# EAGLE design M784new (EAGLE 6.6.0)
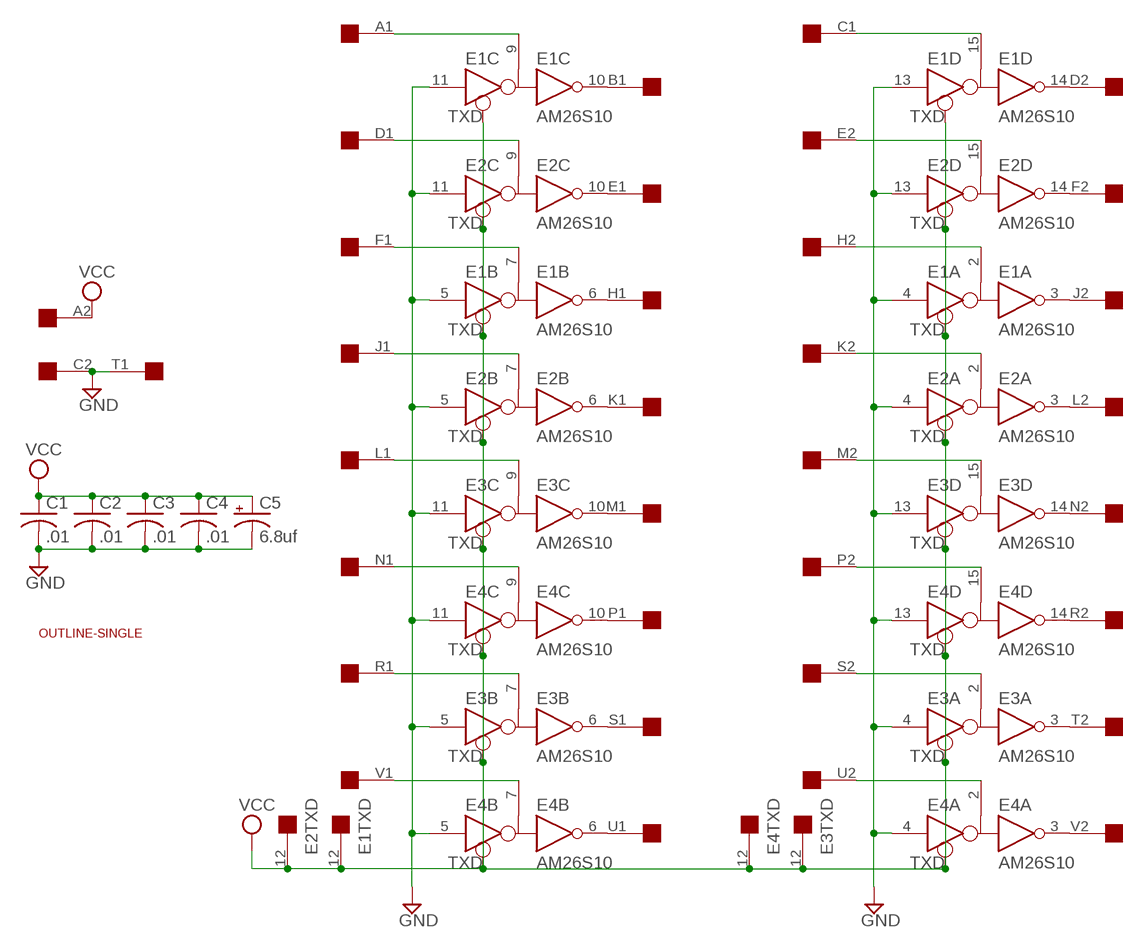
[diagram p0: schematic, sheet 1]

## Parts
C1  .01  C-US050-025X075  [C050-025X075]
C2  .01  C-US050-025X075  [C050-025X075]
C3  .01  C-US050-025X075  [C050-025X075]
C4  .01  C-US050-025X075  [C050-025X075]
C5  6.8uf  CPOL-USE15-5AXIAL  [E15-5]
E1  AM26S10  [DIL16]
E2  AM26S10  [DIL16]
E3  AM26S10  [DIL16]
E4  AM26S10  [DIL16]
U$1  SINGLE  [EDGE-CON2]
U$2  OUTLINE-SINGLE  [SINGLE]

## Nets
GND: C1.2 C2.2 C3.2 C4.2 C5.- E1.4(A:D) E1.5(B:D) E1.11(C:D) E1.13(D:D) E2.4(A:D) E2.5(B:D) E2.11(C:D) E2.13(D:D) E3.4(A:D) E3.5(B:D) E3.11(C:D) E3.13(D:D) E4.4(A:D) E4.5(B:D) E4.11(C:D) E4.13(D:D) U$1.C2 U$1.T1
N$1: E3.10(C:R) U$1.M1
N$2: E3.9(C:B) U$1.L1
N$3: E2.15(D:B) U$1.E2
N$4: E1.14(D:R) U$1.D2
N$5: E4.9(C:B) U$1.N1
N$6: E1.10(C:R) U$1.B1
N$7: E2.2(A:B) U$1.K2
N$8: E2.10(C:R) U$1.E1
N$9: E2.7(B:B) U$1.J1
N$10: E4.10(C:R) U$1.P1
N$11: E1.6(B:R) U$1.H1
N$12: E4.7(B:B) U$1.V1
N$13: E3.6(B:R) U$1.S1
N$14: E2.14(D:R) U$1.F2
N$15: E3.7(B:B) U$1.R1
N$16: E4.6(B:R) U$1.U1
N$17: E1.15(D:B) U$1.C1
N$18: E1.3(A:R) U$1.J2
N$19: E2.3(A:R) U$1.L2
N$20: E1.2(A:B) U$1.H2
N$21: E3.14(D:R) U$1.N2
N$22: E4.14(D:R) U$1.R2
N$23: E3.3(A:R) U$1.T2
N$24: E4.3(A:R) U$1.V2
N$25: E2.6(B:R) U$1.K1
N$26: E3.15(D:B) U$1.M2
N$27: E4.15(D:B) U$1.P2
N$28: E1.7(B:B) U$1.F1
N$29: E3.2(A:B) U$1.S2
N$30: E2.9(C:B) U$1.D1
N$31: E4.2(A:B) U$1.U2
N$32: E1.9(C:B) U$1.A1
VCC: C1.1 C2.1 C3.1 C4.1 C5.+ E1.12(TXD:TXD) E2.12(TXD:TXD) E3.12(TXD:TXD) E4.12(TXD:TXD) U$1.A2
Unconnected: U$1.B2

## Power pins joined to a net without a drawn wire
GND: E1.1(GND:GND) E1.8(PWR:GND) E2.1(GND:GND) E2.8(PWR:GND) E3.1(GND:GND) E3.8(PWR:GND) E4.1(GND:GND) E4.8(PWR:GND)
VCC: E1.16(PWR:VCC) E2.16(PWR:VCC) E3.16(PWR:VCC) E4.16(PWR:VCC)

## Library data of the parts
C1-C4 = rcl:C-US: CAPACITOR, American symbol
C5 = rcl:CPOL-US: POLARIZED CAPACITOR, American symbol
E1-E4 = dec-con:AM26S10: Bus Transceiver
U$1 = dec-con:SINGLE: Single-Height DEC board
U$2 = dec-con:OUTLINE-*: Board outlines for DEC boards.

## Board
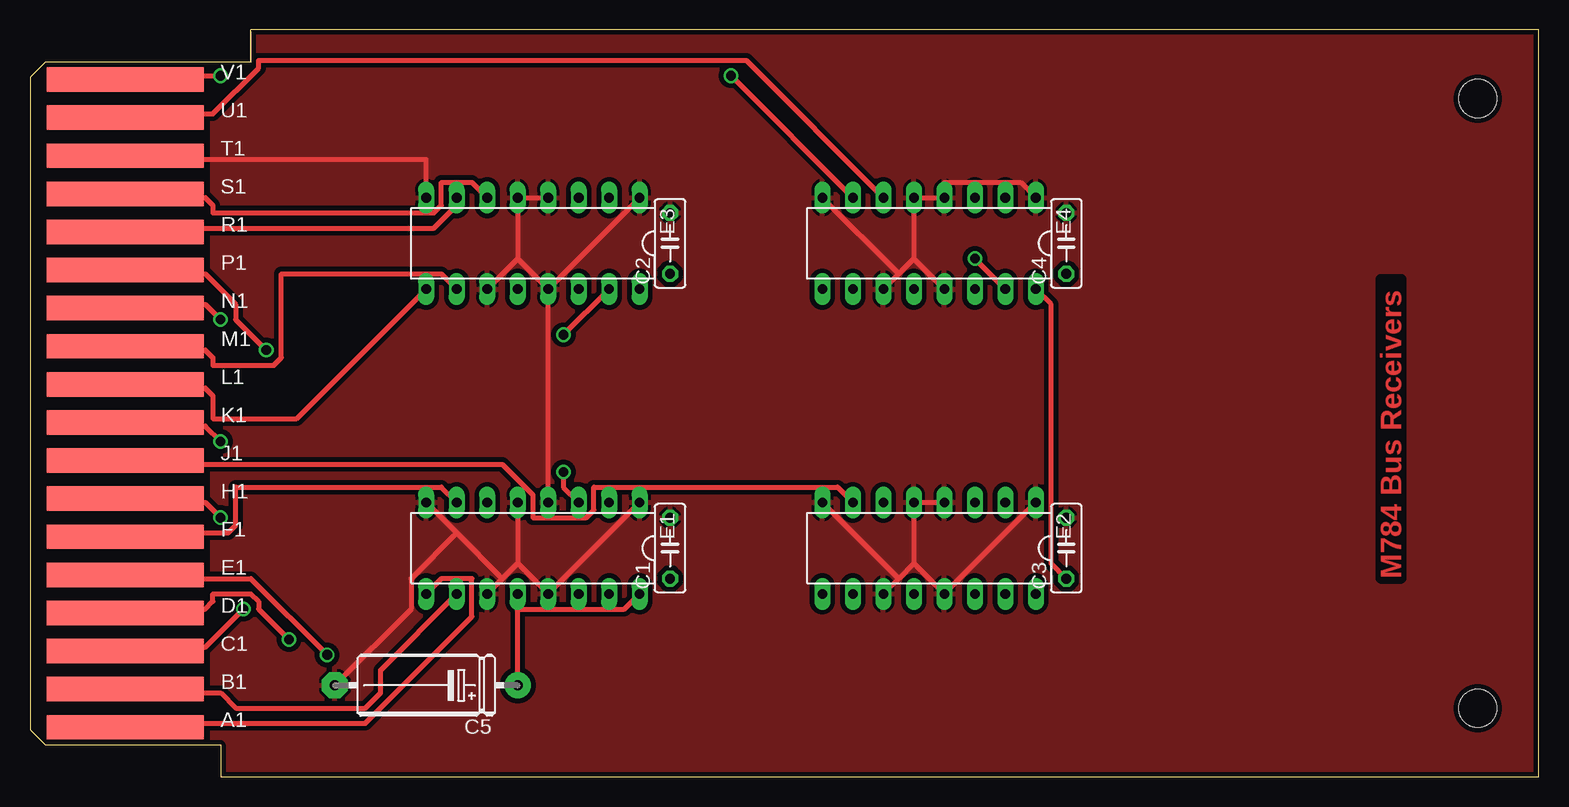
[diagram p1: board, top side]
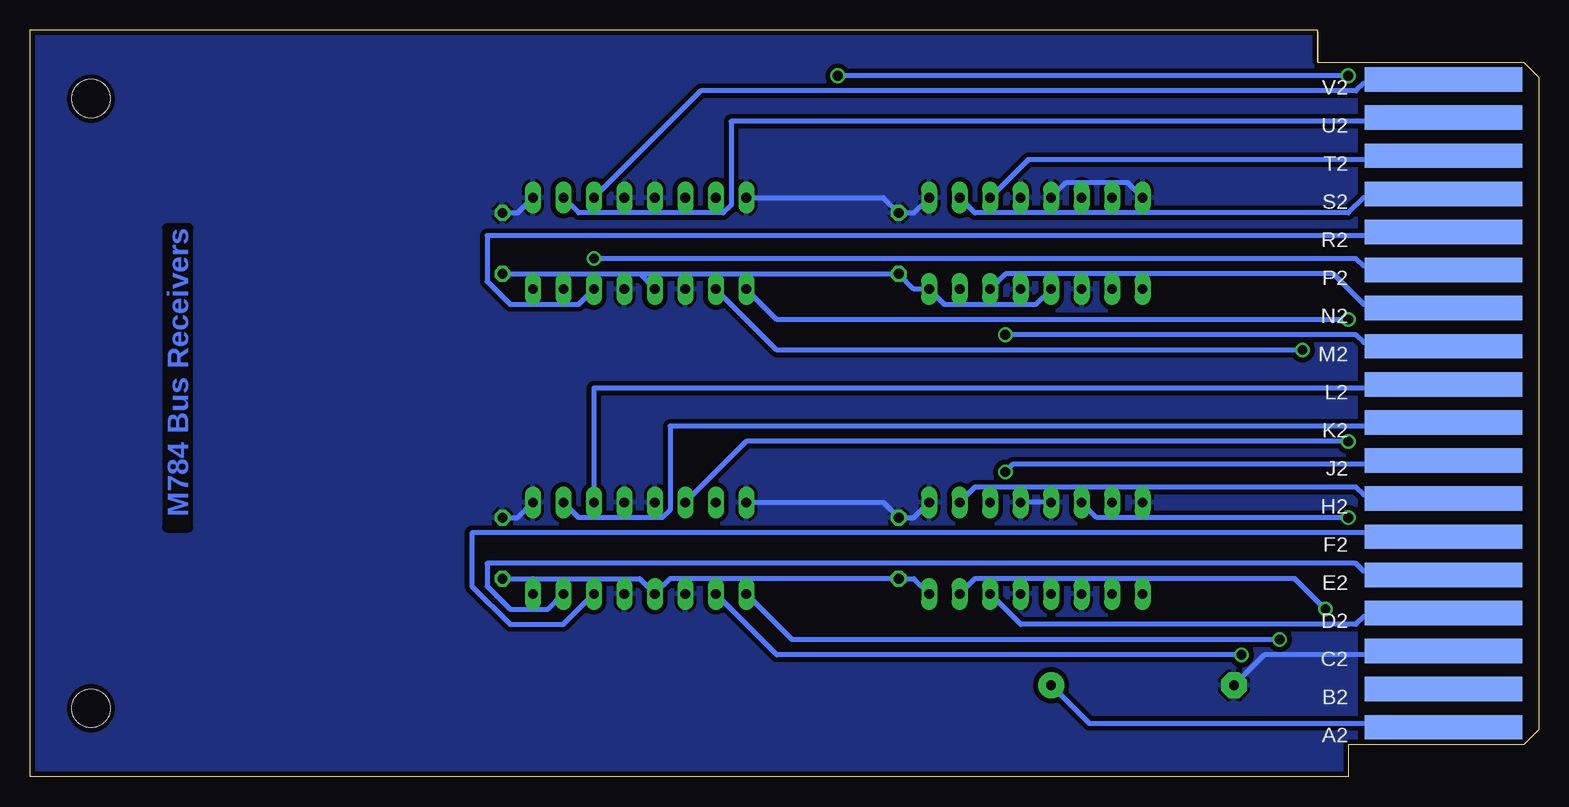
[diagram p2: board, bottom side, seen from below]

Size 125.73 x 62.23 mm. Coordinates in mm from the lower left corner, seen from the top.
Copper layers (1+16): Top 0.035mm / dielectric 1.5mm / Bottom 0.035mm
Design rules "16mils": minimum track width 16mil, minimum drill 32mil, track to track 15mil, track to pad 10mil, pad to pad 10mil, via to via 10mil, smd to smd 10mil, copper to edge 13mil, drill to drill 10mil, minimum pad ring 10mil, minimum via ring 8mil, stop-mask expansion 0mil, vias tented up to drill 0mil, thermal gap 10mil

### Footprints (pad centres in the part's own frame; a part is rotated, then mirrored left to right if it is on the bottom)
C050-025X075 = drill 0.813 octagon: 1 -2.54,0; 2 2.54,0
E15-5 = drill 0.813 pad 2.159: + -7.62,0 | drill 0.813 pad 2.159 octagon: - 7.62,0
DIL16 = drill 0.813 long: 1 -8.89,-3.81; 2 -6.35,-3.81; 3 -3.81,-3.81; 4 -1.27,-3.81; 5 1.27,-3.81; 6 3.81,-3.81; 7 6.35,-3.81; 8 8.89,-3.81; 9 8.89,3.81; 10 6.35,3.81; 11 3.81,3.81; 12 1.27,3.81; 13 -1.27,3.81; 14 -3.81,3.81; 15 -6.35,3.81; 16 -8.89,3.81
EDGE-CON2 = smd 13.106 x 2.032: A1 7.938,4.128; B1 7.938,7.303; C1 7.938,10.477; D1 7.938,13.652; E1 7.938,16.828; F1 7.938,20.003; H1 7.938,23.177; J1 7.938,26.352; K1 7.938,29.527; L1 7.938,32.703; M1 7.938,35.877; N1 7.938,39.053; P1 7.938,42.227; R1 7.938,45.403; S1 7.938,48.578; T1 7.938,51.752; U1 7.938,54.928; V1 7.938,58.102 | smd 13.106 x 2.032 bottom: A2 7.938,4.128; B2 7.938,7.303; C2 7.938,10.477; D2 7.938,13.652; E2 7.938,16.828; F2 7.938,20.003; H2 7.938,23.177; J2 7.938,26.352; K2 7.938,29.527; L2 7.938,32.703; M2 7.938,35.877; N2 7.938,39.053; P2 7.938,42.227; R2 7.938,45.403; S2 7.938,48.578; T2 7.938,51.752; U2 7.938,54.928; V2 7.938,58.102
SINGLE = hole 3.175: 120.65,56.515; 120.65,5.715

### Placement (x,y rotation side)
C1  53.34,19.05 90 top
C2  53.34,44.45 90 top
C3  86.36,19.05 90 top
C4  86.36,44.45 90 top
C5  33.02,7.62 180 top
E1  41.91,19.05 180 top
E2  74.93,19.05 180 top
E3  41.91,44.45 180 top
E4  74.93,44.45 180 top
U$1  0,0 0 top
U$2  0,0 0 top

### Tracks (layer width: path | path; a pad name or v marks a point on that pad's centre or on a via)
GND
  Top 0.406: 40.64,43.18 E3.11 | 40.64,43.18 E3.5 E3.4 | 40.64,43.18 E3.13 | E3.13 E3.1 | 73.66,43.18 72.39,41.91 | 72.39,41.91 E4.11 | 73.66,43.18 E4.5 E4.4 76.2,49.53 82.55,49.53 E4.1 | 73.66,43.18 E4.13 | 72.39,41.91 E4.8 | E3.8 33.02,51.44 8.26,51.44 U$1.T1 | 40.64,17.78 39.37,16.51 | 39.37,16.51 E1.11 | E1.5 40.64,17.78 | 40.64,17.78 E1.13 E1.1 | 39.37,16.51 35.56,20.32 | 35.56,20.32 E1.8 | 73.66,17.78 72.39,16.51 | 72.39,16.51 E2.11 | 73.66,17.78 E2.5 E2.4 | 72.39,16.51 E2.8 | 73.66,17.78 E2.13 E2.1 | C5.- 31.75,13.97 31.75,16.51 35.56,20.32 | E1.4 E3.13
  Bottom 0.406: E3.1 52.07,46.99 C2.2 54.61,48.26 E4.8 | E3.8 34.29,49.53 39.37,49.53 E3.5 | E4.1 85.09,46.99 C4.2 | C5.- 22.86,10.16 8.26,10.16 U$1.C2 | E1.1 52.07,21.59 C1.2 54.61,22.86 E2.8 | E1.5 E1.4 | E2.1 85.09,21.59 C3.2
  pour Top (isolate 0.406): 15.24,62.23 125.73,62.23 125.73,0 15.24,0
  pour Bottom (isolate 0.406): 15.24,62.23 125.73,62.23 125.73,0 15.24,0
N$1
  Top 0.406: E3.10 34.29,41.91 20.96,41.91 20.96,34.92 20.32,34.29 15.24,34.29 15.24,34.92 14.61,35.56 8.26,35.56 U$1.M1
N$2
  Top 0.406: E3.9 22.23,29.84 15.24,29.84 15.24,31.75 14.61,32.38 8.26,32.38 U$1.L1
N$3
  Bottom 0.406: E2.15 82.55,13.97 85.73,13.97 87.63,15.88 87.63,17.78 15.24,17.78 14.61,17.14 8.26,17.14 U$1.E2
N$4
  Bottom 0.406: E1.14 43.18,12.7 15.24,12.7 14.61,13.34 8.26,13.34 U$1.D2
N$5  (via drill 0.81)
  Top 0.406: v15.88,38.1 14.61,39.37 8.26,39.37 U$1.N1
  Bottom 0.406: E4.9 63.5,38.1 v15.88,38.1
N$6
  Top 0.406: E1.10 29.21,8.89 29.21,6.99 27.94,5.71 17.15,5.71 15.88,6.99 8.26,6.99 U$1.B1
N$7
  Bottom 0.406: E2.2 80.01,21.59 73.03,21.59 72.39,22.23 72.39,29.21 8.26,29.21 U$1.K2
N$8  (via drill 0.81)
  Top 0.406: v24.77,10.16 18.42,16.51 8.26,16.51 U$1.E1
  Bottom 0.406: E2.10 63.5,10.16 v24.77,10.16
N$9
  Top 0.406: E2.7 67.31,24.13 46.99,24.13 46.99,22.23 46.36,21.59 41.91,21.59 41.91,23.5 39.37,26.04 8.26,26.04 U$1.J1
N$10  (via drill 0.81)
  Top 0.406: v19.69,35.56 17.15,38.1 17.15,39.37 14.61,41.91 8.26,41.91 U$1.P1
  Bottom 0.406: E4.10 63.5,35.56 v19.69,35.56
N$11  (via drill 0.81)
  Top 0.406: v15.88,21.59 14.61,22.86 8.26,22.86 U$1.H1
  Bottom 0.406: E1.6 36.83,21.59 v15.88,21.59
N$12  (via drill 0.81)
  Top 0.406: v58.42,58.42 E4.7 | v15.88,58.42 8.26,58.42 U$1.V1
  Bottom 0.406: v15.88,58.42 v58.42,58.42
N$13
  Top 0.406: E3.6 36.83,49.53 34.29,49.53 34.29,47.62 33.66,46.99 15.24,46.99 15.24,47.62 14.61,48.26 8.26,48.26 U$1.S1
N$14
  Bottom 0.406: E2.14 81.28,12.7 85.73,12.7 88.9,15.88 88.9,20.32 8.26,20.32 U$1.F2
N$15
  Top 0.406: E3.7 35.56,47.62 33.66,45.72 8.26,45.72 U$1.R1
N$16
  Top 0.406: E4.6 59.69,59.69 19.05,59.69 19.05,59.05 15.24,55.24 8.26,55.24 U$1.U1
N$17  (via drill 0.81)
  Top 0.406: v17.78,13.97 14.61,10.79 8.26,10.79 U$1.C1
  Bottom 0.406: E1.15 46.99,16.51 20.32,16.51 v17.78,13.97
N$18  (via drill 0.81)
  Top 0.406: E1.3 44.45,24.13 v44.45,25.4
  Bottom 0.406: v44.45,25.4 43.82,26.04 8.26,26.04 U$1.J2
N$19
  Bottom 0.406: E2.3 78.74,32.38 8.26,32.38 U$1.L2
N$20
  Bottom 0.406: E1.2 46.99,24.13 15.24,24.13 14.61,23.5 8.26,23.5 U$1.H2
N$21
  Bottom 0.406: E3.14 44.45,41.91 17.15,41.91 14.61,39.37 8.26,39.37 U$1.N2
N$22
  Bottom 0.406: E4.14 80.01,39.37 85.73,39.37 87.63,41.27 87.63,45.09 8.26,45.09 U$1.R2
N$23
  Bottom 0.406: E3.3 42.55,51.44 8.26,51.44 U$1.T2
N$24
  Bottom 0.406: E4.3 69.85,57.15 15.24,57.15 14.61,57.78 8.26,57.78 U$1.V2
N$25  (via drill 0.81)
  Top 0.406: v15.88,27.94 14.61,29.21 8.26,29.21 U$1.K1
  Bottom 0.406: E2.6 66.04,27.94 v15.88,27.94
N$26  (via drill 0.81)
  Top 0.406: v44.45,36.83 E3.15
  Bottom 0.406: v44.45,36.83 15.24,36.83 14.61,36.2 8.26,36.2 U$1.M2
N$27  (via drill 0.81)
  Top 0.406: v78.74,43.18 E4.15
  Bottom 0.406: v78.74,43.18 15.24,43.18 14.61,42.55 8.26,42.55 U$1.P2
N$28
  Top 0.406: E1.7 34.29,24.13 17.15,24.13 17.15,20.95 16.51,20.32 8.26,20.32 U$1.F1
N$29
  Bottom 0.406: E3.2 46.99,46.99 15.88,46.99 14.61,48.26 8.26,48.26 U$1.S2
N$30  (via drill 0.81)
  Top 0.406: v21.59,11.43 19.05,13.97 19.05,14.61 18.42,15.24 15.24,15.24 15.24,14.61 14.61,13.97 8.26,13.97 U$1.D1
  Bottom 0.406: E2.9 62.23,11.43 v21.59,11.43
N$31
  Bottom 0.406: E4.2 80.01,46.99 67.95,46.99 67.31,47.62 67.31,54.61 8.26,54.61 U$1.U2
N$32
  Top 0.406: E1.9 34.29,16.51 36.83,16.51 36.83,13.34 27.94,4.45 8.26,4.45 U$1.A1
VCC
  Top 0.406: C5.+ 40.64,13.97 | 40.64,13.97 E1.12 | E1.16 49.53,13.97 40.64,13.97 | E4.16 85.09,39.37 85.09,17.78 C3.1
  Bottom 0.406: E3.12 41.91,39.37 49.53,39.37 E3.16 52.07,40.64 C2.1 74.93,41.91 | 74.93,41.91 E4.12 | C4.1 83.82,41.91 | 83.82,41.91 74.93,41.91 | 83.82,41.91 E4.16 | C3.1 83.82,16.51 | 83.82,16.51 74.93,16.51 E2.12 72.39,16.51 C1.1 52.07,16.51 E1.16 | 83.82,16.51 E2.16 | C5.+ 37.47,4.45 8.26,4.45 U$1.A2

### Text on the board
Top: M784 Bus Receivers
Bottom: M784 Bus Receivers